# EAGLE design expansion (EAGLE 6.1)
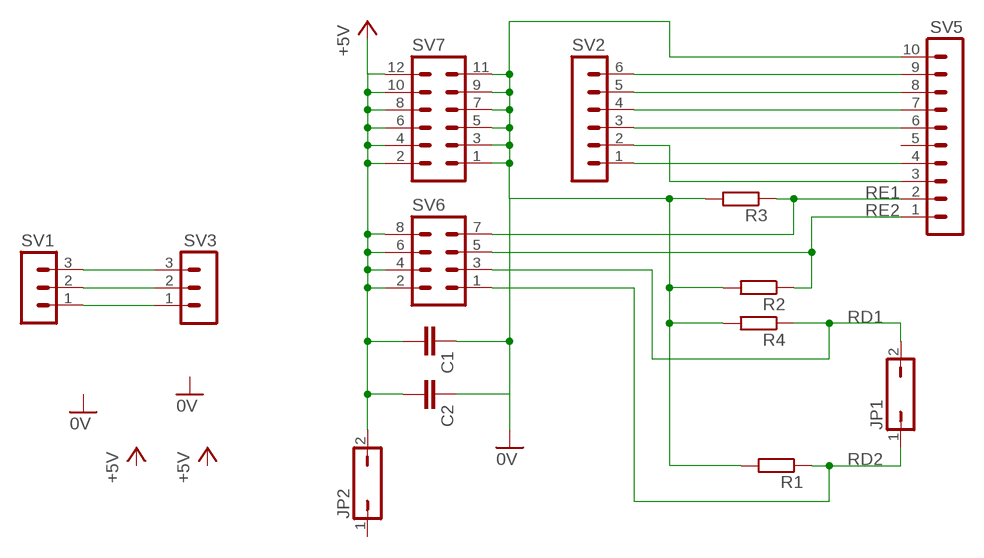
[diagram p0: schematic, sheet 1]

## Parts
C1  C-EU025-030X050  [C025-030X050]
C2  C-EU025-030X050  [C025-030X050]
JP1  JP1Q  [JP1]
JP2  JP1Q  [JP1]
R1  R-EU_0207/10  [0207/10]
R2  R-EU_0207/5V  [0207/5V]
R3  R-EU_0207/2V  [0207/2V]
R4  R-EU_0204/7  [0204/7]
SV1  MA03-1  [MA03-1]
SV2  MA06-1  [MA06-1]
SV3  MA03-1  [MA03-1]
SV5  MA10-1  [MA10-1]
SV6  MA04-2  [MA04-2]
SV7  MA06-2  [MA06-2]

## Nets
0V: C1.1 C2.1 R1.2 R2.2 R3.2 R4.2 SV5.10 SV7.1 SV7.3 SV7.5 SV7.7 SV7.9 SV7.11
+5V: C1.2 C2.2 JP2.2 SV6.2 SV6.4 SV6.6 SV6.8 SV7.2 SV7.4 SV7.6 SV7.8 SV7.10 SV7.12
N$1: SV2.6 SV5.9
N$2: SV2.5 SV5.8
N$3: SV2.4 SV5.7
N$4: SV2.3 SV5.6
N$10: SV1.3 SV3.3
N$11: SV1.2 SV3.2
N$12: SV1.1 SV3.1
N$13: SV2.1 SV5.4
N$15: SV2.2 SV5.3
RD1: JP1.2 R4.1 SV6.3
RD2: JP1.1 R1.1 SV6.1
RE1: R3.1 SV5.2 SV6.7
RE2: R2.1 SV5.1 SV6.5
Unconnected: JP2.1 SV5.5

## Library data of the parts
C1 C2 = rcl:C-EU: CAPACITOR, European symbol
JP1 JP2 = jumper:JP1Q: JUMPER
R1-R4 = rcl:R-EU_: RESISTOR, European symbol
SV1 SV3 = con-lstb:MA03-1: PIN HEADER; OC_FARNELL: unknown; OC_NEWARK: unknown
SV2 = con-lstb:MA06-1: PIN HEADER; OC_FARNELL: unknown; OC_NEWARK: unknown
SV5 = con-lstb:MA10-1: PIN HEADER; OC_FARNELL: unknown; OC_NEWARK: unknown
SV6 = con-lstb:MA04-2: PIN HEADER; OC_FARNELL: unknown; OC_NEWARK: unknown
SV7 = con-lstb:MA06-2: PIN HEADER; OC_FARNELL: unknown; OC_NEWARK: unknown

## Board
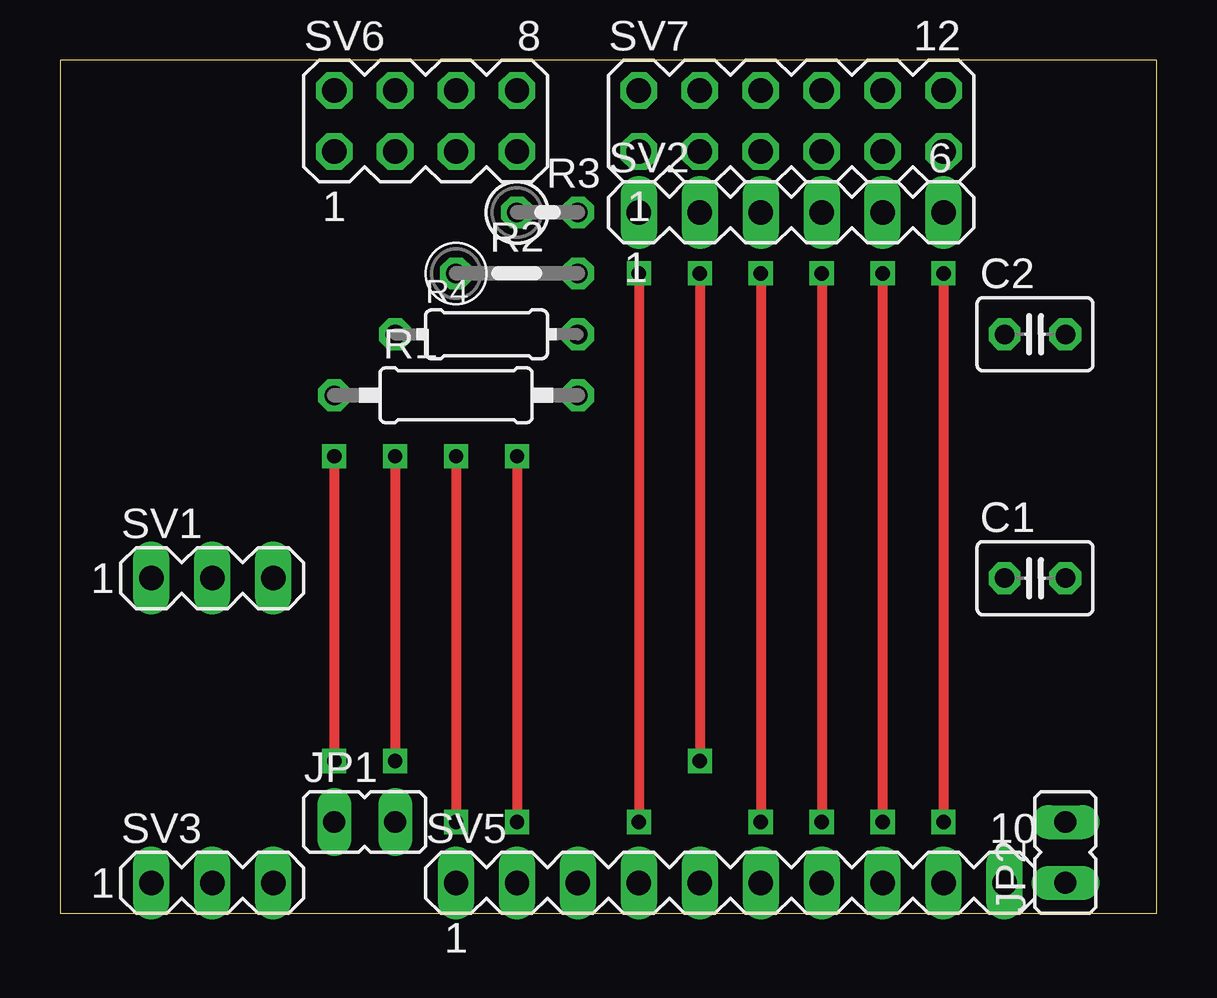
[diagram p1: board, top side]
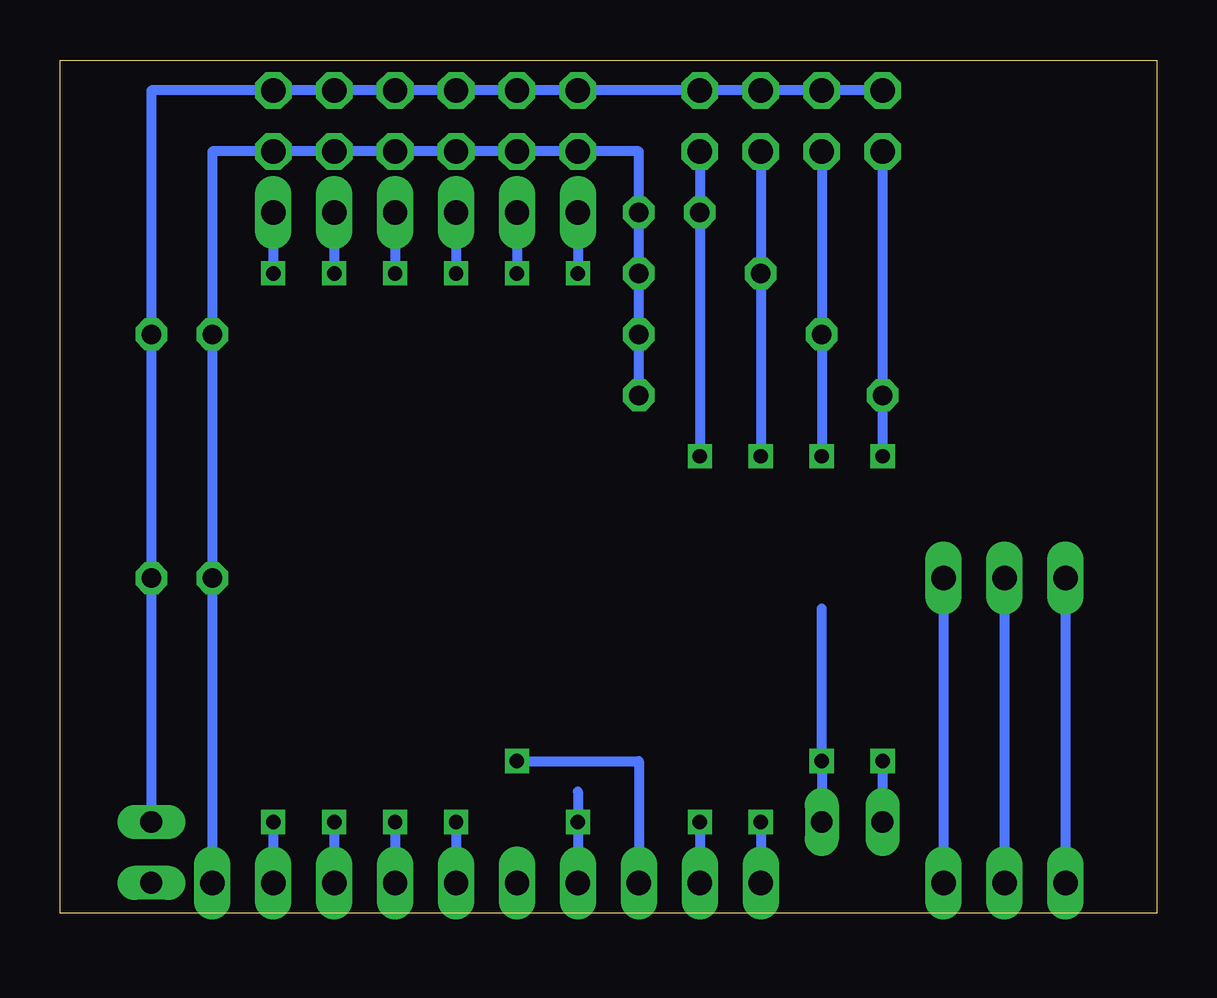
[diagram p2: board, bottom side, seen from below]

Size 45.72 x 35.56 mm. Coordinates in mm from the lower left corner, seen from the top.
Outline: 0,0 45.72,0 45.72,35.56 0,35.56 0,0
Copper layers (1*16): Top 0.035mm / dielectric 1.5mm / Bottom 0.035mm
Design rules: minimum track width 10mil, minimum drill 24mil, track to track 8mil, track to pad 8mil, pad to pad 8mil, via to via 8mil, smd to smd 8mil, copper to edge 40mil, drill to drill 8mil, minimum pad ring 10mil, minimum via ring 8mil, stop-mask expansion 4mil, vias tented up to drill 0mil, thermal gap 10mil

### Footprints (pad centres in the part's own frame; a part is rotated, then mirrored left to right if it is on the bottom)
C025-030X050 = drill 0.813 octagon: 1 -1.27,0; 2 1.27,0
JP1 = drill 0.914 long: 1 0,-1.27; 2 0,1.27
0207/10 = drill 0.813 octagon: 1 -5.08,0; 2 5.08,0
0207/5V = drill 0.813 octagon: 1 -2.54,0; 2 2.54,0
0207/2V = drill 0.813 octagon: 1 -1.27,0; 2 1.27,0
0204/7 = drill 0.813 octagon: 1 -3.81,0; 2 3.81,0
MA03-1 = drill 1.016 long: 1 -2.54,0; 2 0,0; 3 2.54,0
MA06-1 = drill 1.016 long: 1 -6.35,0; 2 -3.81,0; 3 -1.27,0; 4 1.27,0; 5 3.81,0; 6 6.35,0
MA10-1 = drill 1.016 long: 1 -11.43,0; 2 -8.89,0; 3 -6.35,0; 4 -3.81,0; 5 -1.27,0; 6 1.27,0; 7 3.81,0; 8 6.35,0; 9 8.89,0; 10 11.43,0
MA04-2 = drill 1.016 octagon: 1 -3.81,-1.27; 2 -3.81,1.27; 3 -1.27,-1.27; 4 -1.27,1.27; 5 1.27,-1.27; 6 1.27,1.27; 7 3.81,-1.27; 8 3.81,1.27
MA06-2 = drill 1.016 octagon: 1 -6.35,-1.27; 2 -6.35,1.27; 3 -3.81,-1.27; 4 -3.81,1.27; 5 -1.27,-1.27; 6 -1.27,1.27; 7 1.27,-1.27; 8 1.27,1.27; 9 3.81,-1.27; 10 3.81,1.27; 11 6.35,-1.27; 12 6.35,1.27

### Placement (x,y rotation side)
C1  40.64,13.97 0 top
C2  40.64,24.13 0 top
JP1  12.7,3.81 270 top
JP2  41.91,2.54 0 top
R1  16.51,21.59 0 top
R2  19.05,26.67 0 top
R3  20.32,29.21 0 top
R4  17.78,24.13 0 top
SV1  6.35,13.97 0 top
SV2  30.48,29.21 0 top
SV3  6.35,1.27 0 top
SV5  27.94,1.27 0 top
SV6  15.24,33.02 0 top
SV7  30.48,33.02 0 top

### Tracks (layer width: path | path; a pad name or v marks a point on that pad's centre or on a via)
0V
  Bottom 0.406: R1.2 R4.2 R2.2 R3.2 21.59,31.75 SV7.1 SV7.3 SV7.5 SV7.7 SV7.9 SV7.11 39.37,31.75 C2.1 C1.1 SV5.10
+5V
  Bottom 0.406: SV6.2 SV6.4 SV6.6 SV6.8 SV7.2 SV7.4 SV7.6 SV7.8 SV7.10 SV7.12 41.91,34.29 C2.2 C1.2 JP2.2
N$1  (via drill 0.6)
  Top 0.406: v36.83,26.67 v36.83,3.81
  Bottom 0.406: SV2.6 v36.83,26.67 | v36.83,3.81 SV5.9
N$2  (via drill 0.6)
  Top 0.406: v34.29,26.67 v34.29,3.81
  Bottom 0.406: SV2.5 v34.29,26.67 | v34.29,3.81 SV5.8
N$3  (via drill 0.6)
  Top 0.406: v31.75,26.67 v31.75,3.81
  Bottom 0.406: SV2.4 v31.75,26.67 | v31.75,3.81 SV5.7
N$4  (via drill 0.6)
  Top 0.406: v29.21,26.67 v29.21,3.81
  Bottom 0.406: SV2.3 v29.21,26.67 | v29.21,3.81 SV5.6
N$10
  Bottom 0.406: SV1.3 SV3.3
N$11
  Bottom 0.406: SV1.2 SV3.2
N$12
  Bottom 0.406: SV1.1 SV3.1
N$13  (via drill 0.6)
  Top 0.406: v24.13,26.67 v24.13,3.81
  Bottom 0.406: SV2.1 v24.13,26.67 | 24.13,5.08 v24.13,3.81 SV5.4
N$15  (via drill 0.6)
  Top 0.406: v26.67,26.67 v26.67,6.35
  Bottom 0.406: SV2.2 v26.67,26.67 | v26.67,6.35 21.59,6.35 SV5.3
RD1  (via drill 0.6)
  Top 0.406: v13.97,19.05 v13.97,6.35
  Bottom 0.406: v13.97,19.05 R4.1 SV6.3 | 13.97,12.7 v13.97,6.35 JP1.2
RD2  (via drill 0.6)
  Top 0.406: v11.43,19.05 v11.43,6.35
  Bottom 0.406: v11.43,19.05 R1.1 SV6.1 | v11.43,6.35 JP1.1
RE1  (via drill 0.6)
  Top 0.406: v19.05,19.05 v19.05,3.81
  Bottom 0.406: v19.05,19.05 R3.1 SV6.7 | v19.05,3.81 SV5.2
RE2  (via drill 0.6)
  Top 0.406: v16.51,19.05 v16.51,3.81
  Bottom 0.406: v16.51,19.05 R2.1 SV6.5 | v16.51,3.81 SV5.1